# Altium project CE_BJTInfineonSOT343_v1.PrjPcb
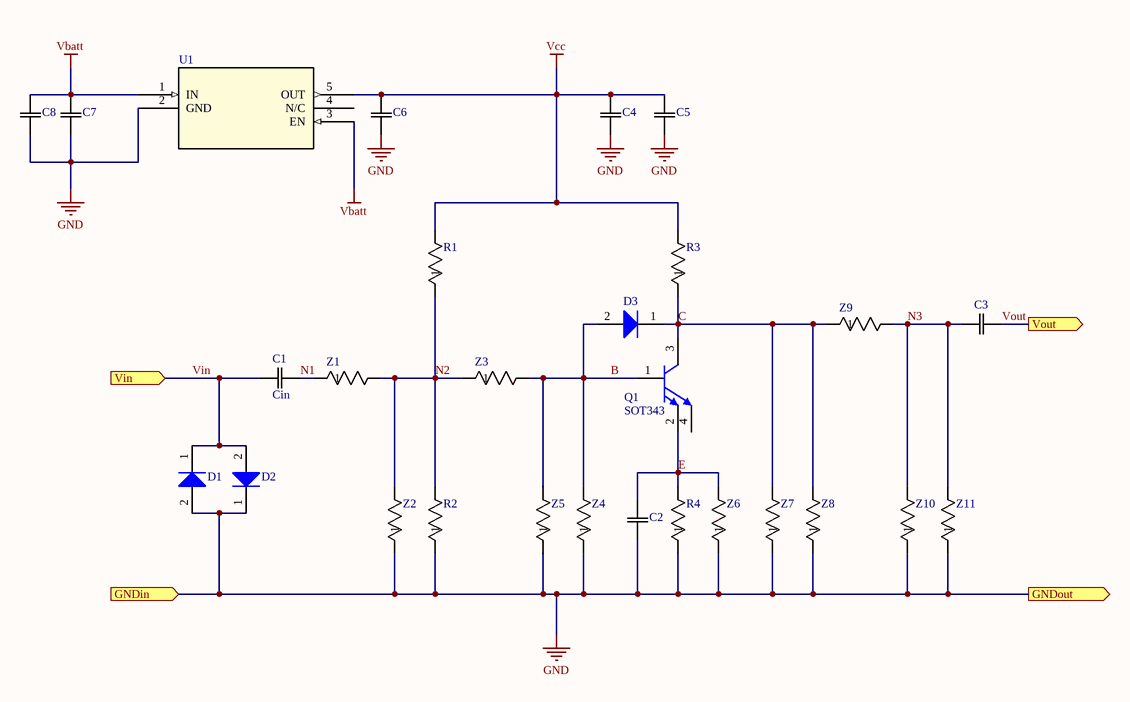
[diagram p0: CE_BJTInfineonSOT343_v1.SchDoc]
1 sheet, 28 parts. Net scope: flat (ports and power ports of the same name join across sheets).
Board file: CE_BJTInfineonSOT343_v1.PcbDoc

## Sheet CE_BJTInfineonSOT343_v1.SchDoc
size A4

### Parts
C1  Cin  [C0201]
C2  (no value)  [C0201]
C3  (no value)  [C0201]
C4  (no value)  [CAP_CBR_0201]
C5  (no value)  [CAP_CBR_0201]
C6  (no value)  [YAG_CC0402]
C7  (no value)  [YAG_CC0402]
C8  (no value)  [YAG_CC0402]
D1  (no value)  [INF-SOD323_V]
D2  (no value)  [INF-SOD323_V]
D3  (no value)  [INF-SOD323_V]
Q1  SOT343  [INF-SOT343_V]
R1  (no value)  [RES_RC0201_P6XP3]
R2  (no value)  [RES_RC0201_P6XP3]
R3  (no value)  [RES_RC0201_P6XP3]
R4  (no value)  [RES_RC0201_P6XP3]
U1  (no value)  [DBV5]
Z1  (no value)  [RES_RC0201_P6XP3]
Z2  (no value)  [RES_RC0201_P6XP3]
Z3  (no value)  [RES_RC0201_P6XP3]
Z4  (no value)  [RES_RC0201_P6XP3]
Z5  (no value)  [RES_RC0201_P6XP3]
Z6  (no value)  [RES_RC0201_P6XP3]
Z7  (no value)  [RES_RC0201_P6XP3]
Z8  (no value)  [RES_RC0201_P6XP3]
Z9  (no value)  [RES_RC0201_P6XP3]
Z10  (no value)  [RES_RC0201_P6XP3]
Z11  (no value)  [RES_RC0201_P6XP3]

### Ports
GNDin (in), GNDout (out), Vin (in), Vout (out)

### Nets
GND: C2.1 C4.1 C5.1 C6.1 C7.1 C8.1 D1.2(A) D2.1(K) R2.1 R4.1 U1.2(GND) Z2.1 Z4.1 Z5.1 Z6.1 Z7.1 Z8.1 Z10.1 Z11.1 ; port GNDin, port GNDout
Vbatt: C7.2 C8.2 U1.1(IN) U1.3(EN)
Vcc: C4.2 C5.2 C6.2 R1.2 R3.2 U1.5(OUT)
B: D3.2(A) Q1.1(B) Z3.2 Z4.2 Z5.2
C: D3.1(K) Q1.3(C) R3.1 Z7.2 Z8.2 Z9.1
E: C2.2 Q1.2(E) R4.2 Z6.2
N1: C1.2 Z1.1
N2: R1.1 R2.2 Z1.2 Z2.2 Z3.1
N3: C3.1 Z9.2 Z10.2 Z11.2
Vin: C1.1 D1.1(K) D2.2(A) ; port Vin
Vout: C3.2 ; port Vout

Not connected (* = marked no-connect by the designer): Q1 4(E); U1 4(N/C)

### Library data of the parts
C1-C3 = C0201C270J3GACTU: No Description Available; Vendor: Kemet; Built_By: EMA_UL_Team; Type: DEV; Manufacturer_Part_Number: C0201C270J3GACTU; Copyright: Copyright (C) 2018 Accelerated Designs. All rights reserved; RefDes: RefDes; Value: Value
C4 C5 = CBR02C399C3GAC: No Description Available; Vendor: KEMET; Built_By: EMA_UL_Team; Type: DEV; Manufacturer_Part_Number: CBR02C399C3GAC; Copyright: Copyright (C) 2018 Accelerated Designs. All rights reserved; RefDes: RefDes; Value: Value
C6-C8 = CC0402KRX7R9BB10: No Description Available; Manufacturer_Part_Number: CC0402KRX7R9BB103; Vendor: Yageo; Built_By: EMA_UL_Team; Type: DEV; Copyright: Copyright (C) 2018 Accelerated Designs. All rights reserved; RefDes: RefDes; Value: Value
D1-D3 = BAT15-03W: Single Silicon Schottky Diode, 110 mA IF Max, SOD32, Green; Manufacturer: Infineon; CT (typ): 0.26 pF; Green: yes; Group: RF Mixer; IF (max): 110 mA; VF (typ): 0.23 V; VR (max): 4 V; DatasheetVersion: Jun-2011; PackageReference: SOD323; PackageDescription: 2-Pin Small Outline Diode Package, 1.25 x 1.7 mm Body; Supplier 1: Mouser; Supplier Part Number 1: N/A; Configuration: Single; Mounting Technology: Surface Mount; PartNumber: BAT15-03W; ComponentLink1Description: Manufacturer URL; ComponentLink1URL: http://www.infineon.com/; ComponentLink2Description: Datasheet; ComponentLink2URL: http://www.infineon.com/dgdl/bat15series.pdf?folderId=db3a304314dca3890114ff6812070b44&fileId=db3a304314dca3890114ff6b74ca0b48&location=en.Products.RF.RF_Mixer___Detector_Schottky_Diodes.DATASHEET.bat15series.pdf; ComponentLink3Description: Package Specification; ComponentLink3URL: http://www.infineon.com/dgdl/SOD323-Package_Overview.pdf?folderId=db3a30431936bc4b011952aab84f3bbe&fileId=db3a30431936bc4b011952beed653be3
Q1 = BFP840ESD: Robust Low Noise Silicon Germanium Bipolar RF Transistor, 2.25 V VCEO, 35 mA IC, 33.5 dB Gmax, SOT343, Green; Manufacturer: Infineon; Gmax (typ): 33.5 dB; Green: yes; Group: Robust ultra low noise SiGe; IC (max): 35 mA; NFmin (typ): 0.6 dB; Ptot (max): 75.0 mW; VCEO (max): 2.25 V; DatasheetVersion: Rev. 1.1; PackageReference: SOT343; PackageDescription: 4-Pin Small Outline Transistor Package, 1.25 x 2 mm Body; Halogen-free: yes; Mounting Technology: Surface Mount; PartNumber: BFP840ESD; ComponentLink1Description: Manufacturer URL; ComponentLink1URL: http://www.infineon.com/; ComponentLink2Description: Datasheet; ComponentLink2URL: http://www.infineon.com/dgdl/Infineon_Robust_WiFi_SiGe_LNA_BFP840ESD_Rev1_1.pdf?folderId=db3a30431f848401011fcbf2ab4c04c4&fileId=db3a304336ca04c90136e88a4d5f35b7&location=en.Products.RF.RF_Transistors_.Ultra_Low_Noise_SiGe_C_Transistors_for_use_up_to_12_GHz.DATASHEET.Infineon_Robust_WiFi_SiGe_LNA_BFP840ESD_Rev1_1.pdf; ComponentLink3Description: Package Specification; ComponentLink3URL: http://www.infineon.com/dgdl/SOT343-Package_Overview.pdf?folderId=db3a30431936bc4b0119535155343cba&fileId=db3a30431936bc4b0119535a9f393cd3
R1-R4 Z1-Z11 = RC0201FR-0718KL: No Description Available; Vendor: Yageo; Built_By: EMA_Anthony; Copyright: Copyright (C) 2018 Accelerated Designs. All rights reserved; Manufacturer_Part_Number: RC0201FR-0718KL; RefDes: RefDes; Type: DEV; Value: Value
U1 = LP5907MFX-3.3/NO: No Description Available; Manufacturer_Part_Number: LP5907MFX-3.3/NOPB; Vendor: Texas Instruments; Built_By: EMA_UL_Team; Copyright: Copyright (C) 2018 Accelerated Designs. All rights reserved; RefDes: RefDes; Type: DEV; Value: Value